# EAGLE design zasilacz (EAGLE 9.6.2)
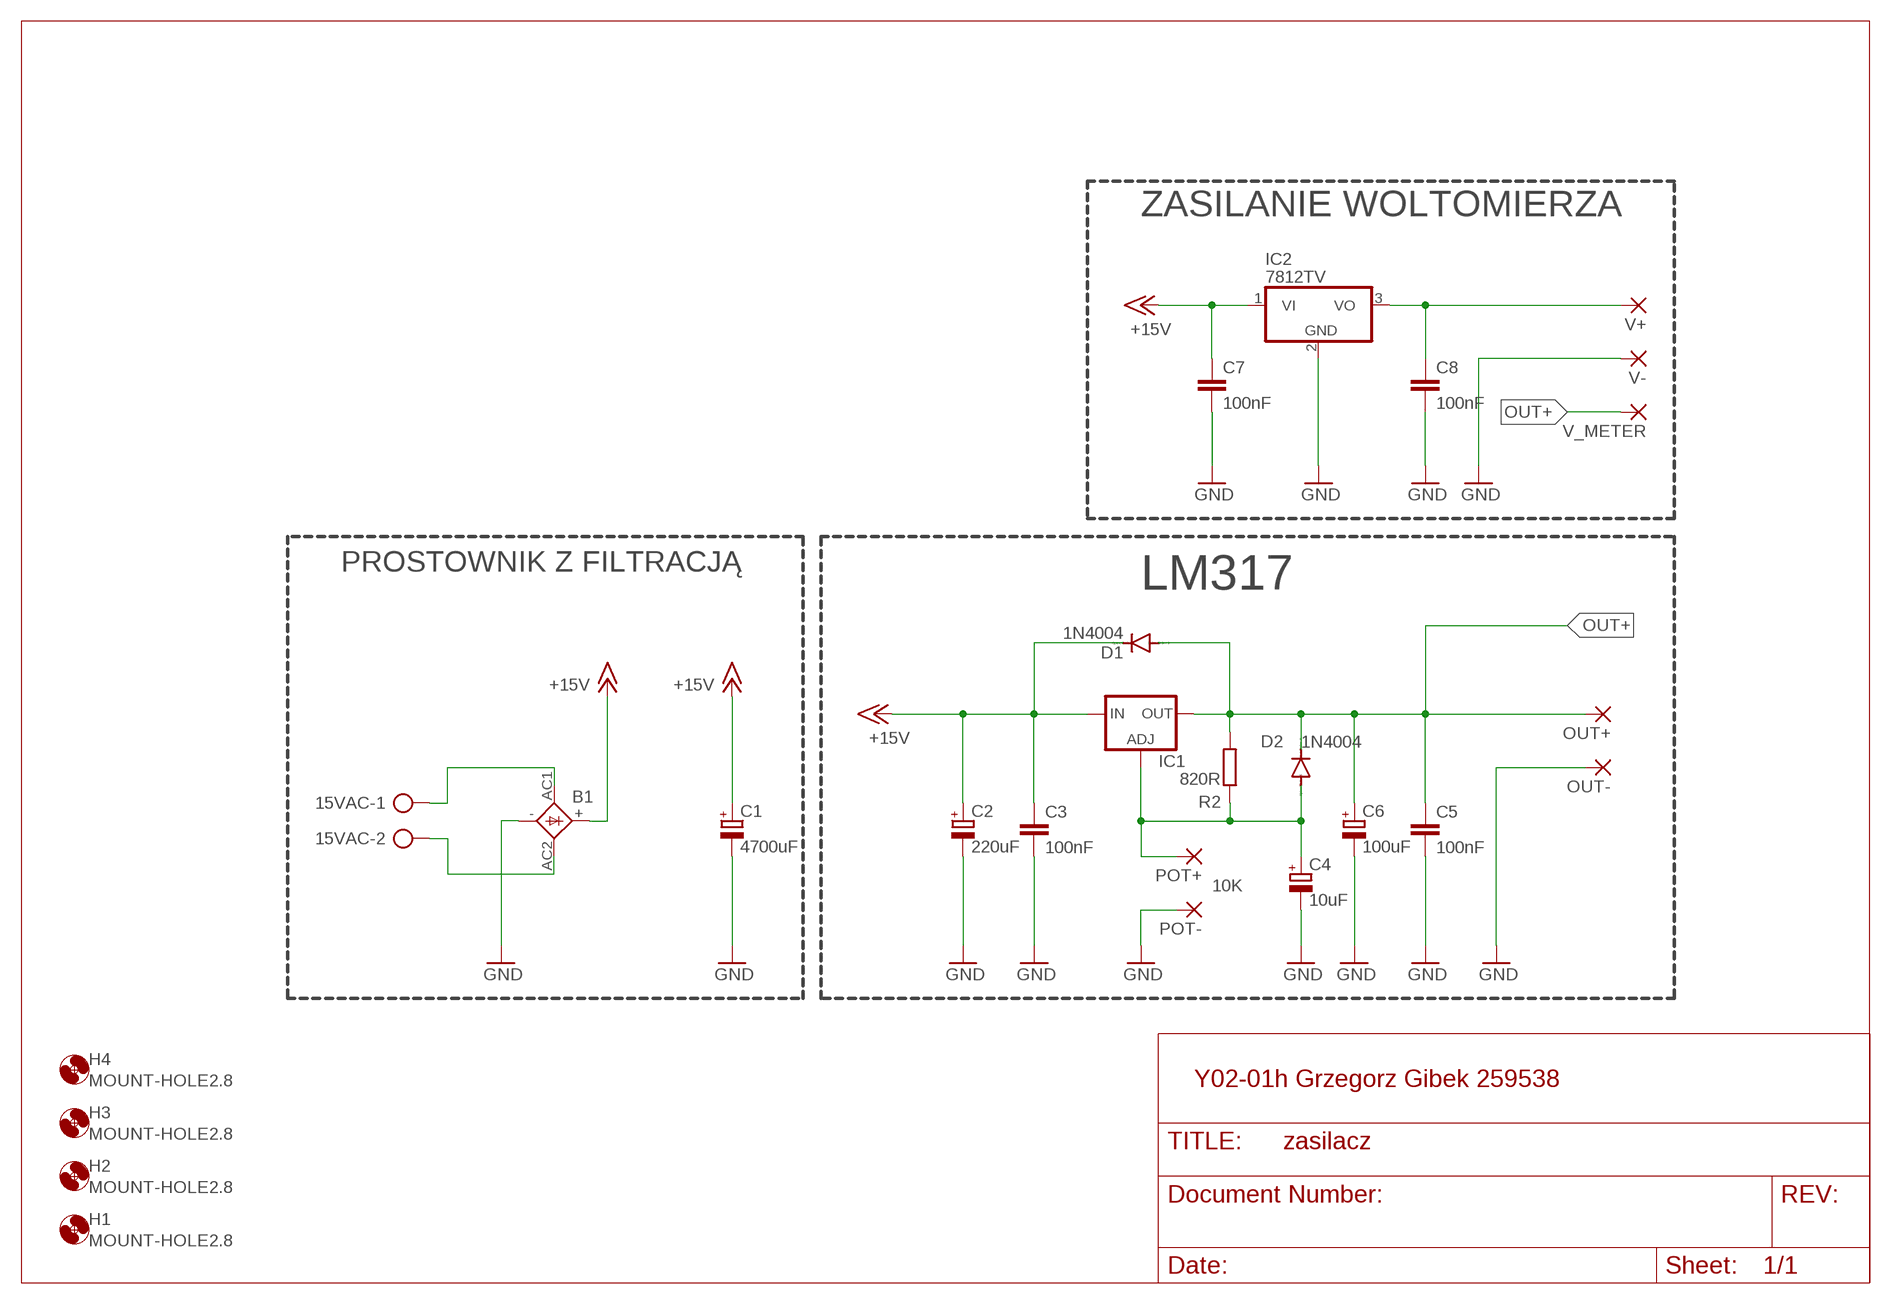
[diagram p0: schematic, sheet 1]

## Parts
15VAC  AK500/2  [AK500/2]
B1  2KBP  [2KBP]
C1  4700uF  CPOL-EUE7.5-18  [E7,5-18]
C2  220uF  CPOL-EUE5-10.5  [E5-10,5]
C3  100nF  C-EU050-025X075  [C050-025X075]
C4  10uF  CPOL-EUE2,5-6E  [E2,5-6E]
C5  100nF  C-EU050-025X075  [C050-025X075]
C6  100uF  CPOL-EUE5-10.5  [E5-10,5]
C7  100nF  C-EU050-025X075  [C050-025X075]
C8  100nF  C-EU050-025X075  [C050-025X075]
D1  1N4004  [DO41-10]
D2  1N4004  [DO41-10]
H1  MOUNT-HOLE2.8  [2,8]
H2  MOUNT-HOLE2.8  [2,8]
H3  MOUNT-HOLE2.8  [2,8]
H4  MOUNT-HOLE2.8  [2,8]
IC1  LM317TS  [317TS]
IC2  7812TV  [TO220V]
OUT+  3,81/1,4  [3,81/1,4]
OUT-  3,81/1,4  [3,81/1,4]
POT+  3,81/1,4  [3,81/1,4]
POT-  3,81/1,4  [3,81/1,4]
R2  820R  R-EU_0204/7  [0204/7]
V+  3,81/1,4  [3,81/1,4]
V-  3,81/1,4  [3,81/1,4]
V_METER  3,81/1,4  [3,81/1,4]

## Nets
+15V: B1.+ C1.+ C2.+ C3.1 C7.1 D1.C IC1.3(IN) IC2.1(VI)
ADJ: C4.+ D2.A IC1.1(ADJ) POT+.1(P) R2.1
GND: B1.- C1.- C2.- C3.2 C4.- C5.2 C6.- C7.2 C8.2 IC2.2(GND) OUT-.1(P) POT-.1(P) V-.1(P)
N$2: 15VAC.1 B1.AC1
N$3: 15VAC.2 B1.AC2
OUT+: C5.1 C6.+ D1.A D2.C IC1.2(OUT) OUT+.1(P) R2.2 V_METER.1(P)
V_ZAS: C8.1 IC2.3(VO) V+.1(P)

## Notes on the sheet
- ZASILANIE WOLTOMIERZA
- PROSTOWNIK Z FILTRACJĄ
- LM317
- 10K
- Y02-01h Grzegorz Gibek 259538

## Library data of the parts
15VAC = con-ptr500:AK500/2: CONNECTOR; OC_FARNELL: unknown; OC_NEWARK: unknown
B1 = rectifier:2KBP: RECTIFIER grid 3 x 3,81 mm
C1 C2 C4 C6 = rcl:CPOL-EU: POLARIZED CAPACITOR, European symbol; SPICEPREFIX: C
C3 C5 C7 C8 = rcl:C-EU: CAPACITOR, European symbol; SPICEPREFIX: C
D1 D2 = diode:1N4004: DIODE general purpose rectifier, 1 A
H1-H4 = holes:MOUNT-HOLE: MOUNTING HOLE with drill center marker
IC1 = v-reg:LM317TS: VOLTAGE REGULATOR
IC2 = linear:78*: Positive VOLTAGE REGULATOR Source: http://cache.national.com/ds/LM/LM78L05.pdf http://www.fairchildsemi.com/ds/LM/LM7805.pdf
OUT+ OUT- POT+ POT- V+ V- V_METER = wirepad:3,81/1,4: THROUGH-HOLE PAD
R2 = rcl:R-EU_: RESISTOR, European symbol; SPICEPREFIX: R

## Board
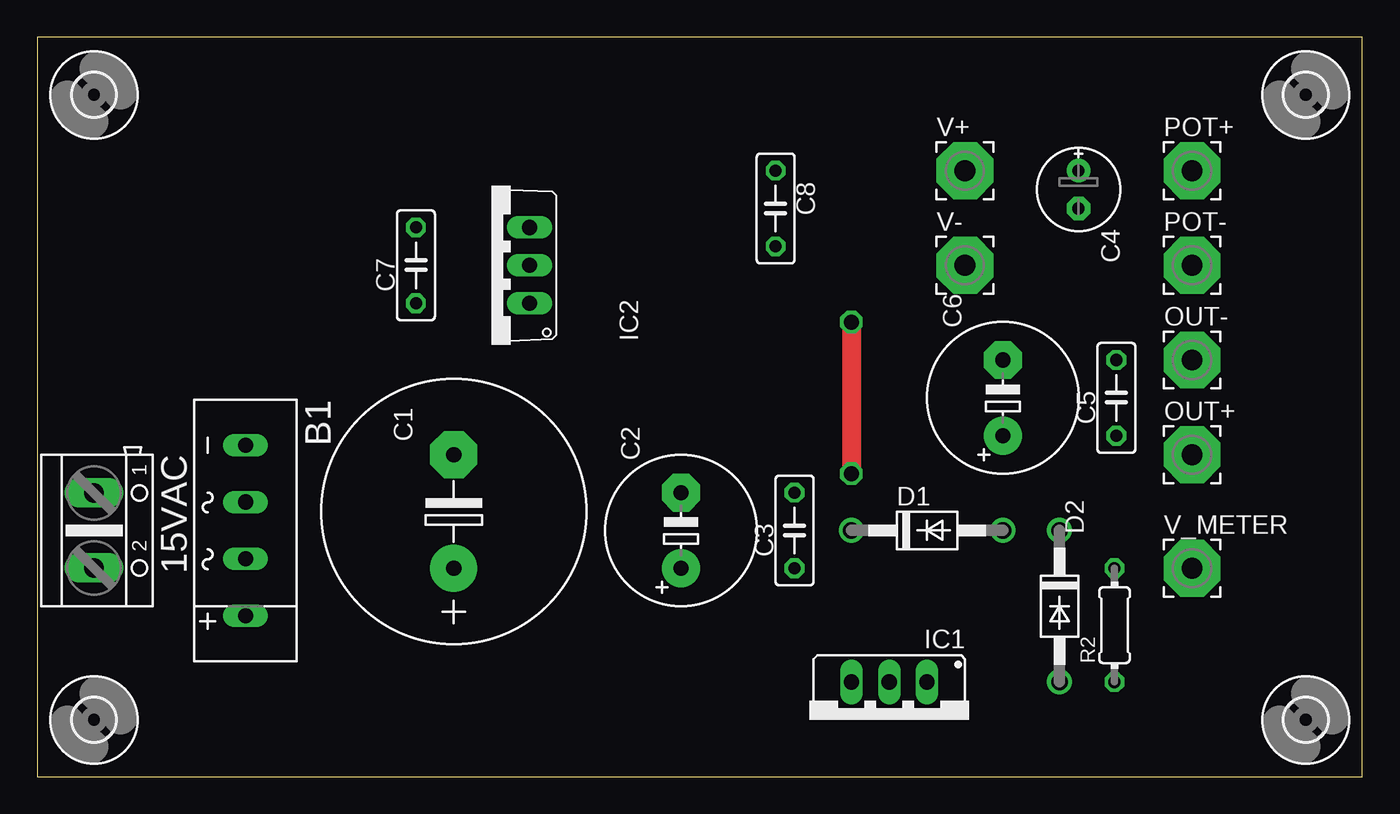
[diagram p1: board, top side]
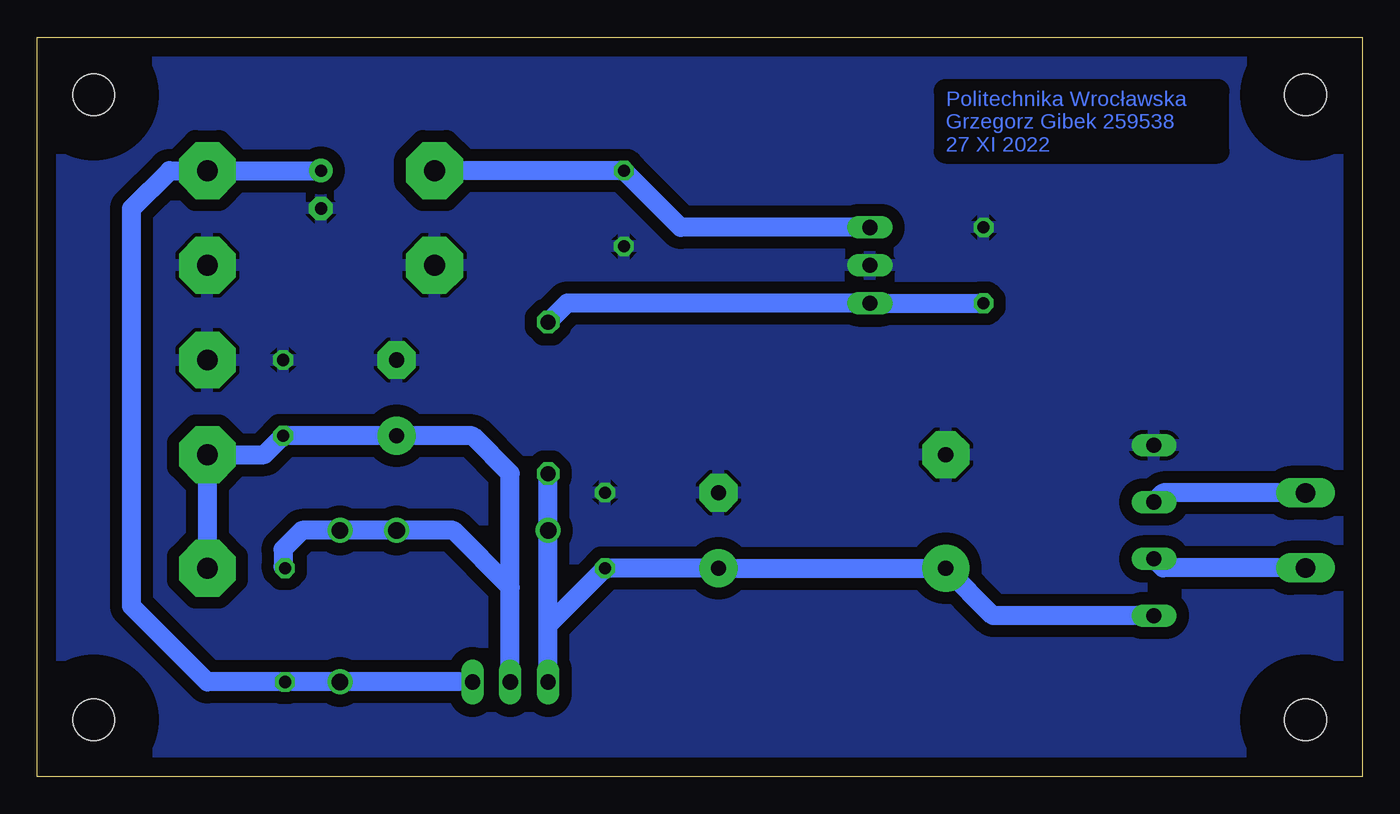
[diagram p2: board, bottom side, seen from below]

Size 88.88 x 49.58 mm. Coordinates in mm from the lower left corner, seen from the top.
Outline: 0,0 88.88,0 88.88,49.58 0,49.58 0,0
Copper layers (1*16): Top 0.035mm / dielectric 1.5mm / Bottom 0.035mm
Design rules "default *": minimum track width 6mil, minimum drill 0.35mm, track to track 20mil, track to pad 6mil, pad to pad 6mil, via to via 6mil, smd to smd 6mil, copper to edge 50mil, drill to drill 50mil, minimum pad ring 10mil, minimum via ring 8mil, stop-mask expansion 4mil, vias tented up to drill 0mil, thermal gap 10mil

### Footprints (pad centres in the part's own frame; a part is rotated, then mirrored left to right if it is on the bottom)
AK500/2 = drill 1.321 long: 1 -2.515,0; 2 2.515,0
2KBP = drill 1.016 long: + 5.715,0; - -5.715,0; AC1 -1.905,0; AC2 1.905,0
E7,5-18 = drill 1.016 pad 3.15: + -3.81,0 | drill 1.016 pad 3.15 octagon: - 3.81,0
E5-10,5 = drill 1.016 pad 2.54: + -2.54,0 | drill 1.016 pad 2.54 octagon: - 2.54,0
C050-025X075 = drill 0.813 octagon: 1 -2.54,0; 2 2.54,0
E2,5-6E = drill 0.813 pad 1.575: + -1.27,0 | drill 0.813 pad 1.575 octagon: - 1.27,0
DO41-10 = drill 1.118: A 5.08,0; C -5.08,0
2,8 = hole 2.8: 0,0
317TS = drill 1.016 long: 1 -2.54,-2.54; 2 0,-2.54; 3 2.54,-2.54
TO220V = drill 1.016 long: 1 -2.54,-2.54; 2 0,-2.54; 3 2.54,-2.54
3,81/1,4 = drill 1.397 pad 3.81 octagon: 1 0,0
0204/7 = drill 0.813 octagon: 1 -3.81,0; 2 3.81,0

### Placement (x,y rotation side)
15VAC  3.81,16.51 270 top
B1  13.97,16.51 270 top
C1  27.94,17.78 90 top
C2  43.18,16.51 90 top
C3  50.8,16.51 90 top
C4  69.85,39.37 270 top
C5  72.39,25.4 90 top
C6  64.77,25.4 90 top
C7  25.4,34.29 90 top
C8  49.53,38.1 270 top
D1  59.69,16.51 0 top
D2  68.58,11.43 270 top
H1  3.81,45.72 0 top
H2  3.81,3.81 0 top
H3  85.09,3.81 0 top
H4  85.09,45.72 0 top
IC1  57.15,3.81 180 top
IC2  30.48,34.29 90 top
OUT+  77.47,21.59 0 top
OUT-  77.47,27.94 0 top
POT+  77.47,40.64 0 top
POT-  77.47,34.29 0 top
R2  72.26,10.16 90 top
V+  62.23,40.64 0 top
V-  62.23,34.29 0 top
V_METER  77.47,13.97 0 top

### Tracks (layer width: path | path; a pad name or v marks a point on that pad's centre or on a via)
+15V  (via drill 1)
  Top 1.27: v54.61,30.48 v54.61,20.32
  Bottom 1.27: IC1.3 54.61,10.16 | 54.61,10.16 C3.1 C2.+ C1.+ 24.77,10.79 B1.+ | 54.61,10.16 D1.C v54.61,20.32 | C7.1 IC2.1 53.34,31.75 v54.61,30.48
ADJ
  Bottom 1.27: C4.+ POT+.1 80.01,40.64 82.55,38.1 82.55,11.43 77.47,6.35 R2.1 D2.A IC1.1
GND
  pour Bottom (isolate 0.813): 0,49.53 88.9,49.53 88.9,0 0,0
N$2
  Bottom 1.27: 15VAC.1 13.36,19.02 B1.AC1
N$3
  Bottom 1.27: 15VAC.2 13.36,13.99 B1.AC2
OUT+
  Bottom 1.27: V_METER.1 OUT+.1 73.66,21.59 C5.1 C6.+ 59.69,22.86 57.15,20.32 57.15,12.7 | IC1.2 57.15,12.7 | 57.15,12.7 60.96,16.51 D1.A D2.C 71.12,16.51 72.39,15.24 72.39,14.1 R2.2
V_ZAS
  Bottom 1.27: IC2.3 45.72,36.83 C8.1 V+.1

### Text on the board
Bottom: Politechnika Wrocławska / Grzegorz Gibek 259538 / 27 XI 2022